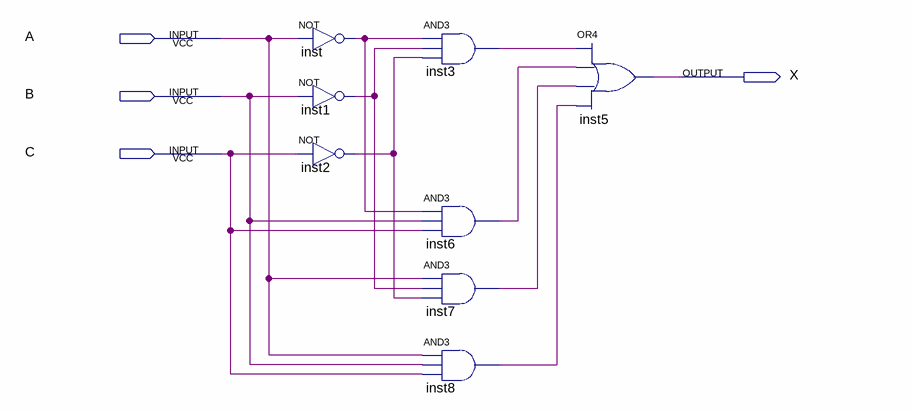
[diagram p0: schematic sheet]
// Quartus schematic principal.bdf as structural Verilog: 8 symbols, 4 pins
module principal (
  input  A,
  input  B,
  input  C,
  output X
);

  wire inst1_out, inst2_out, inst3_out, inst6_out, inst7_out, inst8_out, inst_out;

  not inst (inst_out, A);
  not inst1 (inst1_out, B);
  not inst2 (inst2_out, C);
  and inst3 (inst3_out, inst_out, inst1_out, inst2_out);
  and inst6 (inst6_out, inst_out, B, C);
  and inst7 (inst7_out, A, inst1_out, inst2_out);
  and inst8 (inst8_out, A, B, C);
  or inst5 (X, inst3_out, inst6_out, inst7_out, inst8_out);
endmodule
